# EAGLE design Wilssen_core_v0.201a (EAGLE 6.3)
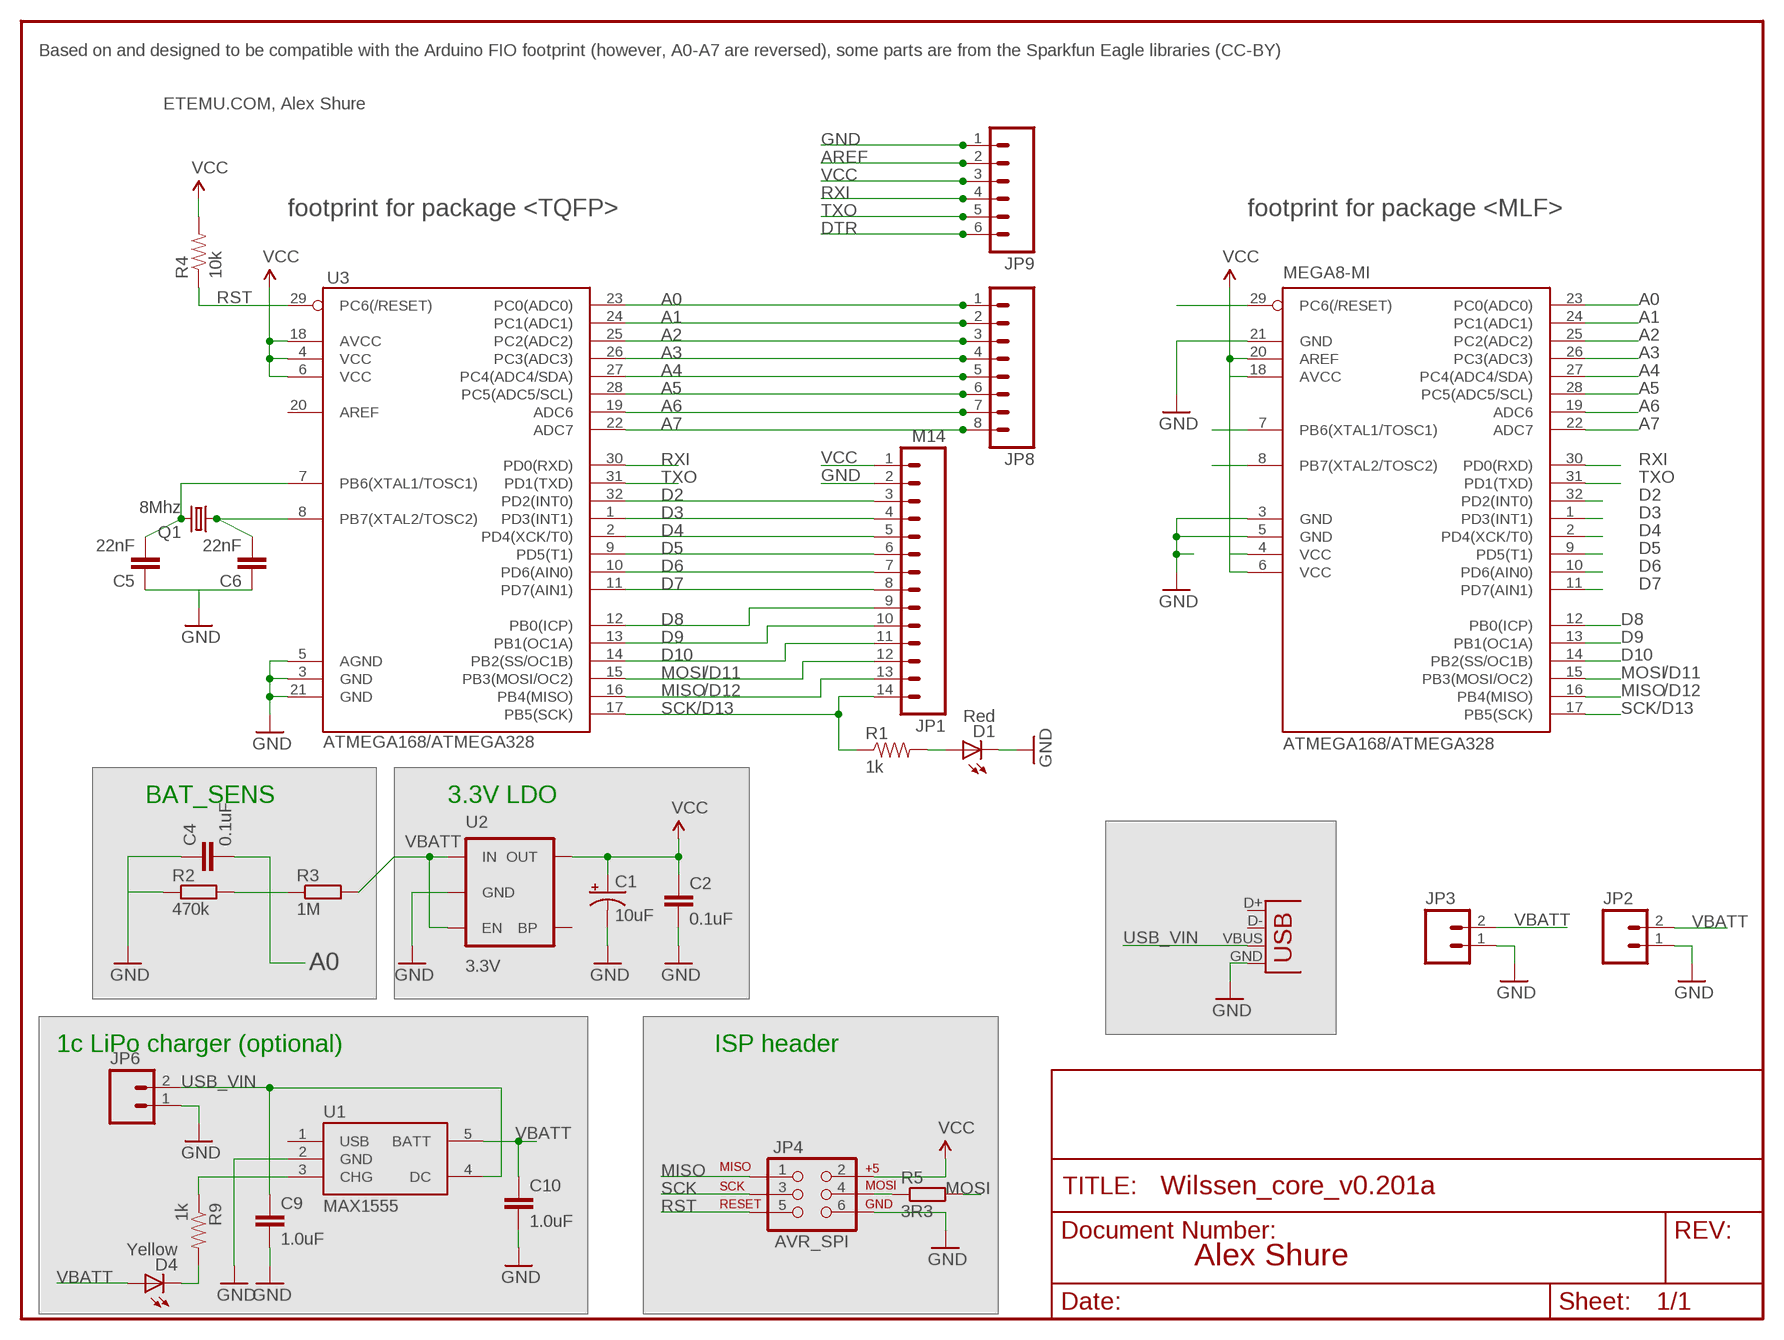
[diagram p0: schematic, sheet 1]

## Parts
ATMEGA168/ATMEGA328  MEGA8-MI  [MLF32]
C1  10uF  CAP_POL1206  [EIA3216]
C2  0.1uF  CAP0805  [0805]
C4  0.1uF  CAP0805  [0805]
C5  22nF  CAP0805  [0805]
C6  22nF  CAP0805  [0805]
C9  1.0uF  CAP0402-CAP  [0402-CAP]
C10  1.0uF  CAP0402-CAP  [0402-CAP]
D1  Red  LED0603  [LED-0603]
D4  Yellow  LED0603  [LED-0603]
JP1  M14  [1X14]
JP2  M02PTH  [1X02]
JP3  M02-JST-2MM-SMT  [S2B-PH]
JP4  AVR_SPI  AVR_SPI_PRG_6PTH  [2X3]
JP6  M02PTH  [1X02]
JP8  M081X08  [1X08]
JP9  M06SIP  [1X06]
Q1  8Mhz  CRYSTALSM49  [SM49]
R1  1k  RESISTOR  [0805]
R2  470k  R-EU_R0805  [R0805]
R3  1M  R-EU_R0805  [R0805]
R4  10k  RESISTOR1206  [1206]
R5  3R3  R-EU_R1206  [R1206]
R9  1k  RESISTOR0402-RES  [0402-RES]
U1  MAX1555  [SOT23-5]
U2  3.3V  V_REG_LDOSMD  [SOT23-5]
U3  ATMEGA168/ATMEGA328  ATMEGA168  [TQFP32-08]
X1  USBSMD  [USB-MINIB]

## Nets
A0: ATMEGA168/ATMEGA328.23(PC0(ADC0)) C4.2 JP8.1 R2.2 R3.1 U3.23(PC0(ADC0))
A1: ATMEGA168/ATMEGA328.24(PC1(ADC1)) JP8.2 U3.24(PC1(ADC1))
A2: ATMEGA168/ATMEGA328.25(PC2(ADC2)) JP8.3 U3.25(PC2(ADC2))
A3: ATMEGA168/ATMEGA328.26(PC3(ADC3)) JP8.4 U3.26(PC3(ADC3))
A4: ATMEGA168/ATMEGA328.27(PC4(ADC4/SDA)) JP8.5 U3.27(PC4(ADC4/SDA))
A5: ATMEGA168/ATMEGA328.28(PC5(ADC5/SCL)) JP8.6 U3.28(PC5(ADC5/SCL))
A6: ATMEGA168/ATMEGA328.19(ADC6) JP8.7 U3.19(ADC6)
A7: ATMEGA168/ATMEGA328.22(ADC7) JP8.8 U3.22(ADC7)
AREF: JP9.2
D2: ATMEGA168/ATMEGA328.32(PD2(INT0)) JP1.3 U3.32(PD2(INT0))
D3: ATMEGA168/ATMEGA328.1(PD3(INT1)) JP1.4 U3.1(PD3(INT1))
D4: ATMEGA168/ATMEGA328.2(PD4(XCK/T0)) JP1.5 U3.2(PD4(XCK/T0))
D5: ATMEGA168/ATMEGA328.9(PD5(T1)) JP1.6 U3.9(PD5(T1))
D6: ATMEGA168/ATMEGA328.10(PD6(AIN0)) JP1.7 U3.10(PD6(AIN0))
D7: ATMEGA168/ATMEGA328.11(PD7(AIN1)) JP1.8 U3.11(PD7(AIN1))
D8: ATMEGA168/ATMEGA328.12(PB0(ICP)) JP1.9 U3.12(PB0(ICP))
D9: ATMEGA168/ATMEGA328.13(PB1(OC1A)) JP1.10 U3.13(PB1(OC1A))
D10: ATMEGA168/ATMEGA328.14(PB2(SS/OC1B)) JP1.11 U3.14(PB2(SS/OC1B))
DTR: JP9.6
GND: ATMEGA168/ATMEGA328.3(GND) ATMEGA168/ATMEGA328.5(GND) ATMEGA168/ATMEGA328.21(GND) C1.C(-) C2.2 C4.1 C5.1 C6.1 C9.2 C10.2 D1.C JP1.2 JP2.1 JP3.1 JP4.6 JP6.1 JP9.1 R2.1 U1.2(GND) U2.2(GND) U3.3(GND) U3.5(AGND) U3.21(GND) X1.GND
MISO: ATMEGA168/ATMEGA328.16(PB4(MISO)) JP1.13 JP4.1 U3.16(PB4(MISO))
MOSI: ATMEGA168/ATMEGA328.15(PB3(MOSI/OC2)) JP1.12 R5.2 U3.15(PB3(MOSI/OC2))
N$1: JP4.4 R5.1
N$2: D1.A R1.2
N$8: D4.C R9.2
N$11: R9.1 U1.3(CHG)
RST: JP4.5 R4.1 U3.29(PC6(/RESET))
RST1: ATMEGA168/ATMEGA328.29(PC6(/RESET))
RXI: ATMEGA168/ATMEGA328.30(PD0(RXD)) JP9.4 U3.30(PD0(RXD))
SCK: ATMEGA168/ATMEGA328.17(PB5(SCK)) JP1.14 JP4.3 R1.1 U3.17(PB5(SCK))
TXO: ATMEGA168/ATMEGA328.31(PD1(TXD)) JP9.5 U3.31(PD1(TXD))
USB_VIN: C9.1 JP6.2 U1.4(DC) X1.VBUS
VBATT: C10.1 D4.A JP2.2 JP3.2 R3.2 U1.5(BATT) U2.1(IN) U2.3(EN)
VCC [VCC]: ATMEGA168/ATMEGA328.4(VCC) ATMEGA168/ATMEGA328.6(VCC) ATMEGA168/ATMEGA328.18(AVCC) ATMEGA168/ATMEGA328.20(AREF) C1.A(+) C2.1 JP1.1 JP4.2 JP9.3 R4.2 U2.5(OUT) U3.4(VCC) U3.6(VCC) U3.18(AVCC)
XTAL1: ATMEGA168/ATMEGA328.7(PB6(XTAL1/TOSC1)) C5.2 Q1.2 U3.7(PB6(XTAL1/TOSC1))
XTAL2: ATMEGA168/ATMEGA328.8(PB7(XTAL2/TOSC2)) C6.2 Q1.1 U3.8(PB7(XTAL2/TOSC2))
Unconnected: U1.1(USB) U2.4(BP) U3.20(AREF) X1.D+ X1.D-

## Notes on the sheet
- Based on and designed to be compatible with the Arduino FIO footprint (however, A0-A7 are reversed), some parts are from the Sparkfun Eagle libraries (CC-BY)
- ETEMU.COM, Alex Shure
- footprint for package <TQFP> | footprint for package <MLF>
- /D11 | /D11
- /D12 | /D12
- /D13 | /D13
- BAT_SENS | 3.3V LDO
- 1c LiPo charger (optional) | ISP header
- Alex Shure

## Library data of the parts
ATMEGA168/ATMEGA328 = atmel:MEGA8: MICROCONTROLLER 8 Kbytes FLASH, 1 kbytes SRAM, 512 bytes EEPROM, USART, 6-channel 10 bit ADC, 2-channel 8 bit ADC Pin compatible with Atmega48, ATMega88, ATMega168 Source: avr.lbr; MPN: ATMEGA88PA-MU; OC_FARNELL: 1715491; OC_NEWARK: 15R0272
C1 = SparkFun:CAP_POL: Capacitor Polarized These are standard SMD and PTH capacitors. Normally 10uF, 47uF, and 100uF in electrolytic and tantalum varieties. Always verify the external diameter of the through hole cap, it varies with capacity, voltage, and manufacturer. The EIA devices should be standard.
C2 C4-C6 C9 C10 = SparkFun:CAP: Capacitor Standard 0603 ceramic capacitor, and 0.1" leaded capacitor.
D1 D4 = SparkFun:LED: LEDs Standard schematic elements and footprints for 5mm, 3mm, 1206, and 0603 sized LEDs. 5mm - Spark Fun Electronics SKU : COM-00529 (and others)
JP1 = SparkFun:M14: Header 14 Standard 14-pin 0.1" header. Use with straight break away headers (SKU : PRT-00116), right angle break away headers (PRT-00553), swiss pins (PRT-00743), machine pins (PRT-00117), and female headers (PRT-00115).
JP2 JP3 JP6 = SparkFun:M02: Header 2 Standard 2-pin 0.1" header. Use with straight break away headers (SKU : PRT-00116), right angle break away headers (PRT-00553), swiss pins (PRT-00743), machine pins (PRT-00117), and female headers (PRT-00115). Molex polarized connector foot print use with SKU : PRT-08233 with associated crimp pins and housings.
JP4 = SparkFun:AVR_SPI_PRG_6: AVR ISP 6 Pin This is the reduced ISP connector for AVR programming. Common on Arduino. This footprint will take up less PCB space and can be used with a 10-pin to 6-pin adapter such as SKU: BOB-08508
JP8 = SparkFun-Connectors:M08: Header 8 Standard 8-pin 0.1" header. Use with straight break away headers (SKU : PRT-00116), right angle break away headers (PRT-00553), swiss pins (PRT-00743), machine pins (PRT-00117), and female headers (PRT-00115).
JP9 = SparkFun-Connectors:M06: Header 6 Standard 6-pin 0.1" header. Use with straight break away headers (SKU : PRT-00116), right angle break away headers (PRT-00553), swiss pins (PRT-00743), machine pins (PRT-00117), and female headers (PRT-00115). Molex polarized connector foot print use with SKU : PRT-08094 with associated crimp pins and housings. NOTES ON THE VARIANTS LOCK and LOCK_LONGPADS... This footprint was designed to help hold the alignment of a through-hole component (i.e. 6-pin header) while soldering it into place. You may notice that each hole has been shifted either up or down by 0.005 of an inch from it's more standard position (which is a perfectly straight line). This slight alteration caused the pins (the squares in the middle) to touch the edges of the holes. Because they are alternating, it causes a "brace" to hold the component in place. 0.005 has proven to be the perfect amount of "off-center" position when using our standard breakaway headers. Although looks a little odd when you look at the bare footprint, once you have a header in there, the alteration is very hard to notice. Also, if you push a header all the way into place, it is covered up entirely on the bottom side. This idea of altering the position of holes to aid alignment will be further integrated into the Sparkfun Library for other footprints. It can help hold any component with 3 or more connection pins.
Q1 = crystal:CRYSTAL: CRYSTAL; OC_FARNELL: unknown; OC_NEWARK: unknown
R1 R4 R9 = SparkFun:RESISTOR: Resistor Basic schematic elements and footprints for 0603, 1206, and PTH 1/10th watt (small) resistors.
R2 R3 R5 = rcl:R-EU_: RESISTOR, European symbol
U1 = SparkFun:MAX1555: MAX1555 Lithium Charger IC SOT-23 Lithium Polymer charging IC. Schematic element and footprint proven. Spark Fun Electronics SKU : COM-00674
U2 = SparkFun:V_REG_LDO: Voltage Regulator LDO Standard 150mA LDO voltage regulator in SOT-23 layout. Micrel part MIC5205. BP (by-pass) pin is used to lower output noise with 470pF cap.
U3 = SparkFun:ATMEGA168
X1 = SparkFun:USB: USB Connectors USB-B-PTH is fully proven SKU : PRT-00139 USB-miniB is fully proven SKU : PRT-00587 USB-A-PCB is untested. USB-A-H is throughly reviewed, but untested. Spark Fun Electronics SKU : PRT-00437 USB-B-SMT is throughly reviewed, but untested. Needs silkscreen touching up. USB-A-S has not been used/tested USB-MB-H has not been used/tested

## Net classes
0 Default: width 0.203 mm
1 VCC: width 0.381 mm
2 LEDPower: width 0.203 mm
3 ButtonSignal: width 0.203 mm

## Board
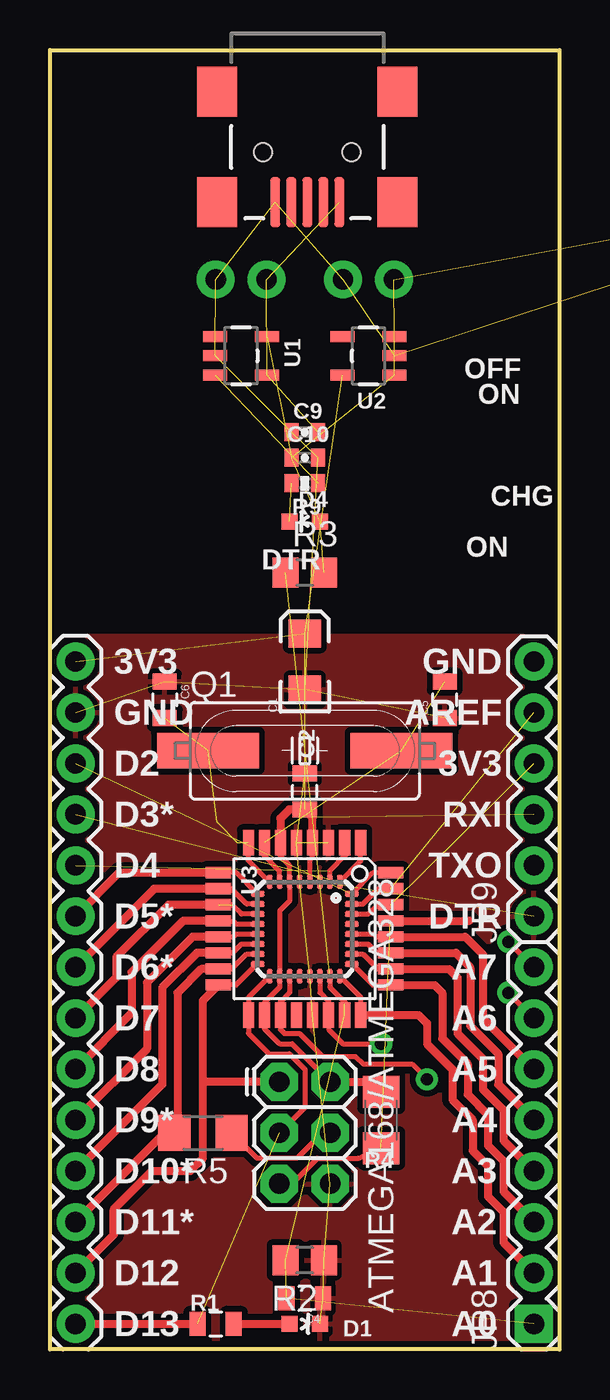
[diagram p1: board, top side]
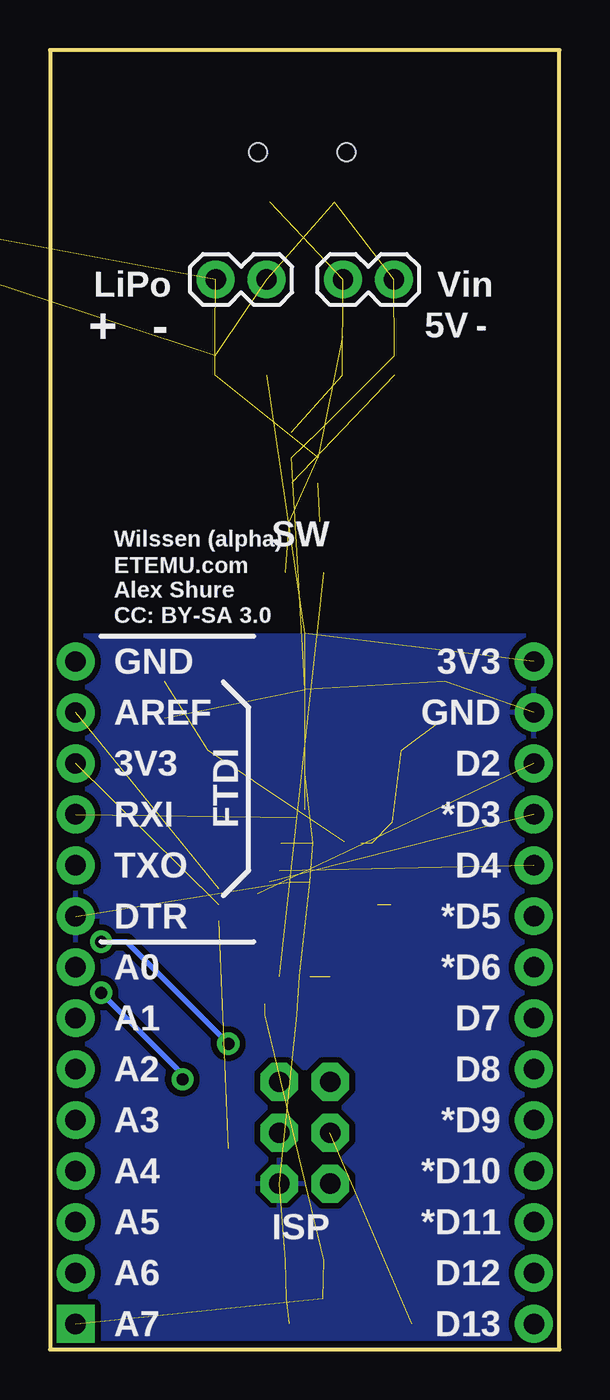
[diagram p2: board, bottom side, seen from below]

Size 25.4 x 64.77 mm. Coordinates in mm from the lower left corner, seen from the top.
Outline: 25.4,64.77 25.4,0 0,0 0,64.77 25.4,64.77
Copper layers (1*16): Top 0.035mm / dielectric 1.5mm / Bottom 0.035mm
Design rules "SparkFun *": minimum track width 8mil, minimum drill 20mil, track to track 8mil, track to pad 8mil, pad to pad 8mil, via to via 8mil, smd to smd 8mil, copper to edge 10mil, drill to drill 8mil, minimum pad ring 12mil, minimum via ring 10mil, stop-mask expansion 4mil, vias tented up to drill 25mil, thermal gap 10mil

### Footprints (pad centres in the part's own frame; a part is rotated, then mirrored left to right if it is on the bottom)
MLF32 = smd 0.7 x 0.3: 1 -2.35,1.75; 2 -2.35,1.25; 3 -2.35,0.75; 4 -2.35,0.25; 5 -2.35,-0.25; 6 -2.35,-0.75; 7 -2.35,-1.25; 8 -2.35,-1.75; 17 2.35,-1.75; 18 2.35,-1.25; 19 2.35,-0.75; 20 2.35,-0.25; 21 2.35,0.25; 22 2.35,0.75; 23 2.35,1.25; 24 2.35,1.75 | smd 0.3 x 0.7: 9 -1.75,-2.35; 10 -1.25,-2.35; 11 -0.75,-2.35; 12 -0.25,-2.35; 13 0.25,-2.35; 14 0.75,-2.35; 15 1.25,-2.35; 16 1.75,-2.35; 25 1.75,2.35; 26 1.25,2.35; 27 0.75,2.35; 28 0.25,2.35; 29 -0.25,2.35; 30 -0.75,2.35; 31 -1.25,2.35; 32 -1.75,2.35
EIA3216 = smd 1.4 x 1.6: A 1.4,0; C -1.4,0
0805 = smd 0.8 x 1.2: 1 -0.9,0; 2 0.9,0
0402-CAP = smd 0.7 x 0.9: 1 -0.65,0; 2 0.65,0
LED-0603 = smd 0.8 x 0.8: A 0,-0.75; C 0,0.75
1X14 = drill 1.016 pad 1.88: 1 0,0; 2 2.54,0; 3 5.08,0; 4 7.62,0; 5 10.16,0; 6 12.7,0; 7 15.24,0; 8 17.78,0; 9 20.32,0; 10 22.86,0; 11 25.4,0; 12 27.94,0; 13 30.48,0; 14 33.02,0
1X02 = drill 1.016 pad 1.88: 1 0,0; 2 2.54,0
S2B-PH = smd 1 x 4.6: 1 -1,-3.7; 2 1,-3.7 | smd 1.6 x 3.4: NC1 -3.4,1.5; NC2 3.4,1.5
2X3 = drill 1.016 pad 1.88 octagon: 1 0,0; 2 0,2.54; 3 2.54,0; 4 2.54,2.54; 5 5.08,0; 6 5.08,2.54
1X08 = drill 1.016 pad 1.88 square: 1 0,0 | drill 1.016 pad 1.88: 2 2.54,0; 3 5.08,0; 4 7.62,0; 5 10.16,0; 6 12.7,0; 7 15.24,0; 8 17.78,0
1X06 = drill 1.016 pad 1.88: 1 0,0; 2 2.54,0; 3 5.08,0; 4 7.62,0; 5 10.16,0; 6 12.7,0
SM49 = smd 5.08 x 1.778: 1 -4.826,0; 2 4.826,0
R0805 = smd 1.3 x 1.5: 1 -0.95,0; 2 0.95,0
1206 = smd 1.6 x 1.8: 1 -1.4,0; 2 1.4,0
R1206 = smd 1.6 x 1.803: 1 -1.422,0; 2 1.422,0
0402-RES = smd 0.7 x 0.9: 1 -0.65,0; 2 0.65,0
SOT23-5 = smd 0.55 x 1.2: 1 -0.95,-1.3; 2 0,-1.3; 3 0.95,-1.3; 4 0.95,1.3; 5 -0.95,1.3
TQFP32-08 = smd 1.27 x 0.559: 1 -4.293,2.8; 2 -4.293,2; 3 -4.293,1.2; 4 -4.293,0.4; 5 -4.293,-0.4; 6 -4.293,-1.2; 7 -4.293,-2; 8 -4.293,-2.8; 17 4.293,-2.8; 18 4.293,-2; 19 4.293,-1.2; 20 4.293,-0.4; 21 4.293,0.4; 22 4.293,1.2; 23 4.293,2; 24 4.293,2.8 | smd 0.559 x 1.27: 9 -2.8,-4.293; 10 -2,-4.293; 11 -1.2,-4.293; 12 -0.4,-4.293; 13 0.4,-4.293; 14 1.2,-4.293; 15 2,-4.293; 16 2.8,-4.293; 25 2.8,4.293; 26 2,4.293; 27 1.2,4.293; 28 0.4,4.293; 29 -0.4,4.293; 30 -1.2,4.293; 31 -2,4.293; 32 -2.8,4.293
USB-MINIB = smd 2.5 x 0.508: D+ 2.5,0; D- 2.5,0.8; GND 2.5,-1.6; ID 2.5,-0.8; VBUS 2.5,1.6 | smd 2.5 x 2: GND@1 -3,-4.5; GND@2 -3,4.5; GND@3 2.5,4.5; GND@4 2.5,-4.5 | hole 0.9: 0,2.2; 0,-2.2

### Placement (x,y rotation side)
ATMEGA168/ATMEGA328  12.7,20.95 270 top
C1  12.7,34.29 90 top
C2  12.7,27.81 90 top
C4  12.7,2.54 180 top
C5  19.68,32.38 90 top
C6  5.71,32.38 270 top
C9  12.7,45.72 180 top
C10  12.7,44.45 0 top
D1  12.7,1.27 270 top
D4  12.7,41.27 90 top
JP1  1.27,34.29 270 top
JP2  14.61,53.34 180 bottom
JP3  47.5,62.87 0 top  (outside the outline)
JP4  11.43,13.34 270 top
JP6  8.26,53.34 180 bottom
JP8  24.13,1.27 90 top
JP9  24.13,21.59 90 top
Q1  12.7,29.84 0 top
R1  8.26,1.27 0 top
R2  12.7,4.45 180 top
R3  12.7,38.73 0 top
R4  16.51,11.43 90 top
R5  7.62,10.79 180 top
R9  12.7,43.18 180 top
U1  9.53,49.53 270 top
U2  15.88,49.53 90 top
U3  12.69,20.96 270 top
X1  12.83,59.69 270 top

### Tracks (layer width: path | path; a pad name or v marks a point on that pad's centre or on a via)
A0  (5 unrouted)
  Top 0.254: ATMEGA168/ATMEGA328.23 13.95,18.05 14.73,17.27 14.69,17.23
A1
  Top 0.254: ATMEGA168/ATMEGA328.24 15.49,17.57 U3.24
  Top 0.406: U3.24 18.38,16.67 18.8,16.26 18.8,15.24 20.07,13.97 20.07,12.45 21.08,11.43 21.08,9.91 21.84,9.14 21.84,7.62 22.61,6.86 22.61,5.33 JP8.2
A2
  Top 0.254: ATMEGA168/ATMEGA328.25 16.09,18.16 U3.25
  Top 0.406: JP8.3 22.61,7.87 22.61,9.4 21.84,10.16 21.84,11.68 20.83,12.7 20.83,14.22 19.56,15.49 19.56,17.78 19.17,18.16 U3.25
A3
  Top 0.254: ATMEGA168/ATMEGA328.26 15.6,19.7 16.34,18.96 U3.26
  Top 0.406: U3.26 19.9,18.96 20.32,18.54 20.32,15.75 21.59,14.48 21.59,12.95 22.61,11.94 22.61,10.41 JP8.4
A4
  Top 0.254: ATMEGA168/ATMEGA328.27 15.86,20.2 16.3,19.77 U3.27
  Top 0.406: U3.27 20.24,19.77 20.95,19.05 20.95,16.13 22.35,14.73 22.35,13.21 JP8.5
A5
  Top 0.254: ATMEGA168/ATMEGA328.28 16.12,20.7 16.27,20.57 U3.28
  Top 0.406: U3.28 20.71,20.57 21.59,19.68 21.59,16.51 JP8.6
A6  (via drill 0.6)
  Top 0.254: ATMEGA168/ATMEGA328.19 11.95,17.79 11.49,17.33 U3.19 11.49,15.94 11.68,15.75 12.45,15.75 13.59,14.61 15.24,14.61 15.62,14.22 18.03,14.22 v18.8,13.46 | v22.86,17.78 JP8.7
  Bottom 0.254: v18.8,13.46 18.8,13.72 v22.86,17.78
A7  (via drill 0.6)
  Top 0.254: ATMEGA168/ATMEGA328.22 13.45,17.79 13.89,17.35 U3.22 13.89,15.96 14.61,15.24 v16.51,15.24 | v22.86,20.32 JP8.8
  Bottom 0.254: v16.51,15.24 21.59,20.32 v22.86,20.32
D2  (1 unrouted)
  Top 0.254: ATMEGA168/ATMEGA328.32 16.11,23.77 U3.32
D3  (1 unrouted)
  Top 0.254: ATMEGA168/ATMEGA328.1 15.49,24.34 U3.1
D4  (1 unrouted)
  Top 0.254: ATMEGA168/ATMEGA328.2 13.95,23.86 14.73,24.64 14.69,24.68 U3.2
D5
  Top 0.254: ATMEGA168/ATMEGA328.9 9.29,23.77 U3.9
  Top 0.406: U3.9 3.44,23.77 JP1.6
D6
  Top 0.254: ATMEGA168/ATMEGA328.10 9.8,22.2 9.04,22.96 U3.10
  Top 0.406: U3.10 5.18,22.96 JP1.7
D7  (1 unrouted)
  Top 0.254: ATMEGA168/ATMEGA328.11 9.54,21.7 9.08,22.16
  Top 0.406: U3.11 5.91,22.16 3.3,19.56 3.3,18.54 JP1.8
D8
  Top 0.254: U3.12 8.43,21.34 9.14,21.34 9.28,21.2 ATMEGA168/ATMEGA328.12
  Top 0.406: U3.12 6.63,21.36 4.06,18.8 4.06,16.76 JP1.9
D9
  Top 0.254: U3.13 9.13,20.57 9.28,20.7 ATMEGA168/ATMEGA328.13
  Top 0.406: U3.13 7.1,20.57 4.83,18.29 4.83,14.99 JP1.10
D10
  Top 0.254: U3.14 9.1,19.77 9.54,20.2 ATMEGA168/ATMEGA328.14
  Top 0.406: U3.14 7.32,19.77 5.59,18.03 5.59,13.21 JP1.11
GND  (23 unrouted)
  pour Top (isolate 0.305): 0,35.56 25.4,35.56 25.4,0 0,0
  pour Bottom (isolate 0.305): 0,35.56 25.4,35.56 25.4,0 0,0
MISO
  Top 0.254: ATMEGA168/ATMEGA328.16 10.31,19.2 9.28,18.16 U3.16
  Top 0.406: JP1.13 3.17,5.71 3.17,6.99 5.08,8.89 6.99,8.89 7.62,9.53 7.62,13.34 | 7.62,13.34 7.62,17.39 U3.16 | JP4.1 7.62,13.34
MOSI
  Top 0.254: U3.15 9.06,18.96 9.8,19.7 ATMEGA168/ATMEGA328.15
  Top 0.406: JP1.12 5.71,10.79 R5.2 6.35,10.95 6.35,17.78 7.54,18.96 U3.15
N$1
  Top 0.254: JP4.4 13.59,10.79 12.32,9.53 10.31,9.53 R5.1
N$2
  Top 0.406: R1.2 D1.A
N$8  (1 unrouted)
N$11  (1 unrouted)
RST  (1 unrouted)
  Top 0.254: JP4.5 12.06,8.26 13.34,9.53 15.37,9.53 R4.1
  Top 0.406: U3.29 20.91,21.36
RXI  (1 unrouted)
  Top 0.254: ATMEGA168/ATMEGA328.30 15.86,21.7 16.32,22.16 U3.30
SCK  (1 unrouted)
  Top 0.254: ATMEGA168/ATMEGA328.17 9.89,17.55 U3.17 9.89,15.76 10.92,14.73 11.94,14.73 12.7,13.97 12.7,12.06 JP4.3
  Top 0.406: JP1.14 R1.1
TXO  (1 unrouted)
  Top 0.254: ATMEGA168/ATMEGA328.31 15.6,22.2 16.36,22.96 U3.31
USB_VIN  (3 unrouted)
VBATT  (7 unrouted)
VCC  (5 unrouted)
  Top 0.254: U3.6 11.49,24.58 11.95,24.12 ATMEGA168/ATMEGA328.6 11.95,22.36 11.45,21.86 ATMEGA168/ATMEGA328.18 11.45,18.05 10.69,17.29 U3.18 10.69,15.98 11.43,15.24 12.06,15.24 JP4.2 13.34,13.97 | ATMEGA168/ATMEGA328.4 12.95,24.38 13.09,24.52 U3.4
  Top 0.406: U3.4 13.09,26.52 C2.1 11.95,26.91 11.94,26.92 11.49,26.48 U3.6 | JP4.2 16,13.34 R4.2
XTAL1  (2 unrouted)
  Top 0.254: ATMEGA168/ATMEGA328.7 11.45,23.86 10.67,24.64 10.69,24.66 U3.7
  Top 0.406: U3.7 10.72,25.29
XTAL2  (4 unrouted)
  Top 0.254: ATMEGA168/ATMEGA328.8 9.89,24.36 U3.8

### Text on the board
tPlace: OFF | ON | CHG | ON | DTR | GND | 3V3 | AREF | GND | 3V3 | D2 | RXI | D3* | TXO | D4 | DTR | D5* | D6* | A7 | D7 | A6 | D8 | A5 | D9* | A4 | D10* | A3 | D11* | A2 | D12 | A1 | D13 | A0
bPlace: Vin | LiPo | - | 5V | - | + | SW | Wilssen (alpha) | ETEMU.com / Alex Shure | CC: BY-SA 3.0 | 3V3 | GND | GND | AREF | D2 | FTDI | 3V3 | *D3 | RXI | D4 | TXO | *D5 | DTR | *D6 | A0 | D7 | A1 | D8 | A2 | *D9 | A3 | *D10 | A4 | *D11 | A5 | ISP | D12 | A6 | D13 | A7